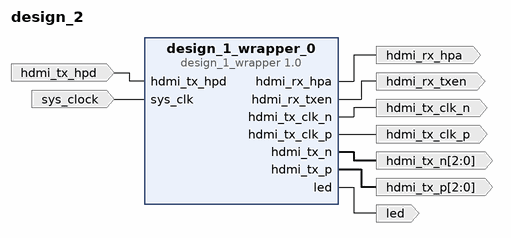
[diagram p0: block diagram of the top level]
# Vivado block design design_2, xc7a200tsbg484-1, Vivado 2016.4
create_bd_design design_2

create_bd_port -dir O -type clk hdmi_tx_clk_p
create_bd_port -dir O -from 2 -to 0 hdmi_tx_n
create_bd_port -dir O -from 2 -to 0 hdmi_tx_p
create_bd_port -dir O hdmi_rx_hpa
create_bd_port -dir O hdmi_rx_txen
create_bd_port -dir O -type clk hdmi_tx_clk_n
create_bd_port -dir O led
create_bd_port -dir I hdmi_tx_hpd
create_bd_port -dir I -type clk sys_clock
set_property -dict {CONFIG.FREQ_HZ 100000000 CONFIG.PHASE 0.000} [get_bd_ports sys_clock]

create_bd_cell -type ip -vlnv xilinx.com:user:design_1_wrapper:1.0 design_1_wrapper_0

# ---- connections ----

connect_bd_net [get_bd_pins design_1_wrapper_0/hdmi_tx_clk_p] [get_bd_ports hdmi_tx_clk_p]
connect_bd_net [get_bd_pins design_1_wrapper_0/hdmi_tx_n] [get_bd_ports hdmi_tx_n]
connect_bd_net [get_bd_pins design_1_wrapper_0/hdmi_tx_p] [get_bd_ports hdmi_tx_p]
connect_bd_net [get_bd_pins design_1_wrapper_0/hdmi_rx_hpa] [get_bd_ports hdmi_rx_hpa]
connect_bd_net [get_bd_pins design_1_wrapper_0/hdmi_rx_txen] [get_bd_ports hdmi_rx_txen]
connect_bd_net [get_bd_pins design_1_wrapper_0/hdmi_tx_clk_n] [get_bd_ports hdmi_tx_clk_n]
connect_bd_net [get_bd_pins design_1_wrapper_0/led] [get_bd_ports led]
connect_bd_net [get_bd_ports hdmi_tx_hpd] [get_bd_pins design_1_wrapper_0/hdmi_tx_hpd]
connect_bd_net [get_bd_ports sys_clock] [get_bd_pins design_1_wrapper_0/sys_clk]

validate_bd_design
save_bd_design
